# Altium schematic sheet BMS.SchDoc
size A; DocumentNumber: 2; SheetNumber: 2; SheetTotal: 3
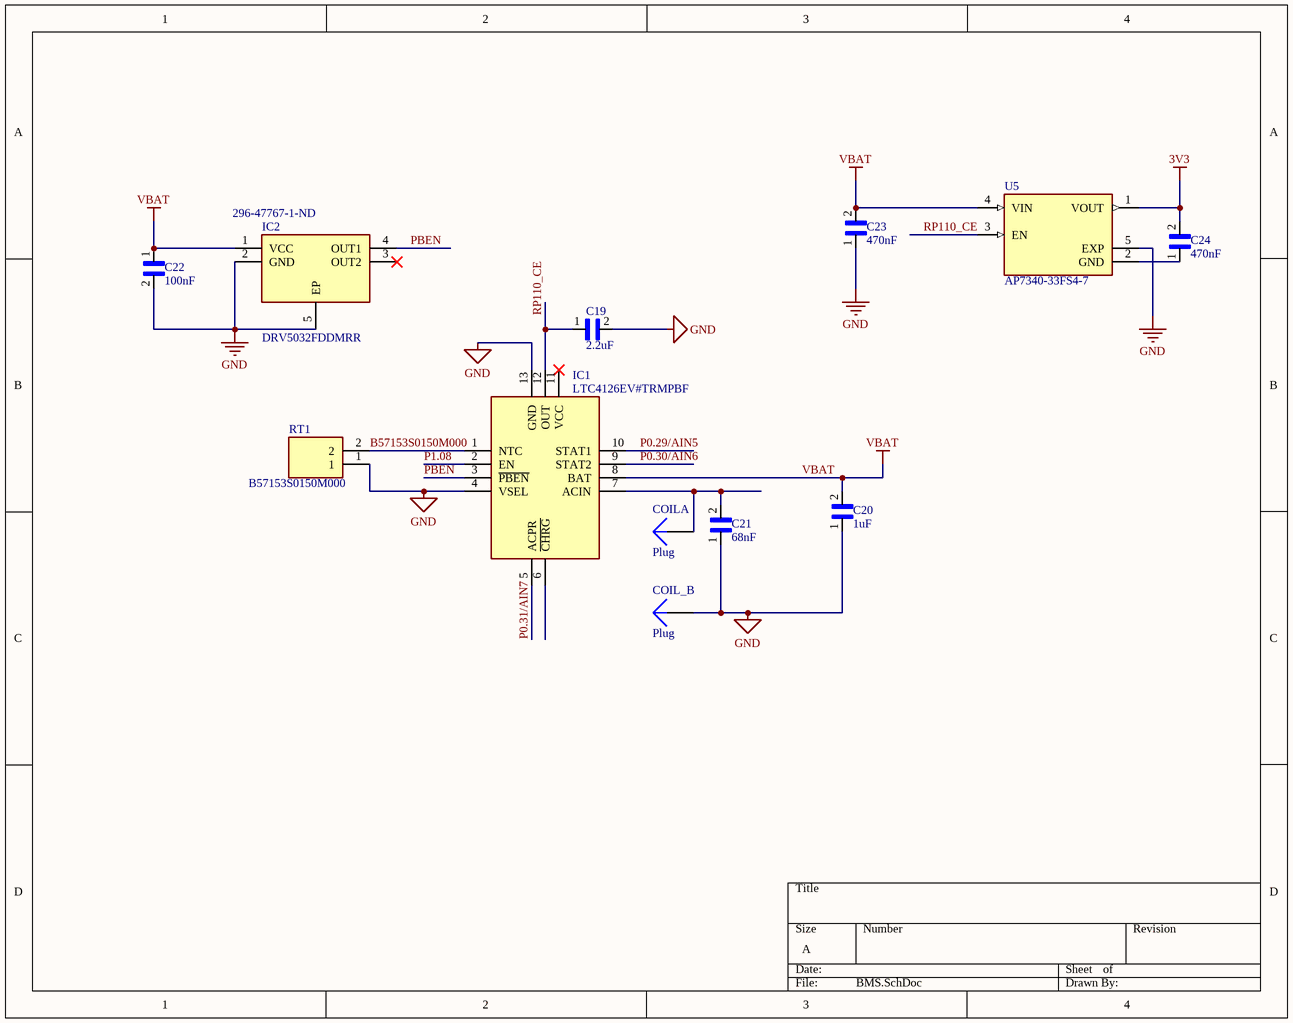
[diagram p0: BMS.SchDoc]

## Parts
C19  2.2uF  [CAPC1005X55N]
C20  1uF  [CAPC1005X56N]
C21  68nF  [CAPC1608X90N]
C22  100nF  [CAPC1005X55N]
C23  470nF  [CAPC0603X33N]
C24  470nF  [CAPC0603X33N]
COIL_B  Plug  [PIN1]
COILA  Plug  [PIN1]
IC1  LTC4126EV#TRMPBF  [QFN50P200X200X83-13N-D]
IC2  DRV5032FDDMRR  Supplier Part Number 1: 296-47767-1-ND  [SON50P140X110X40-5N]
RT1  B57153S0150M000  (graphical)
U5  AP7340-33FS4-7  [VREG_AP7340-33FS4-7]

## Nets
3V3: C24.2 U5.1(VOUT)
GND: C19.2 C20.1 C21.1 C22.2 C23.1 COIL_B.1 IC1.4(VSEL) IC1.13(GND) IC2.2(GND) IC2.5(EP) RT1.1 U5.5(EXP)
VBAT: C20.2 C22.1 C23.2 IC1.8(BAT) IC2.1(VCC) U5.4(VIN)
B57153S0150M000: IC1.1(NTC) RT1.2
P0.29/AIN5: IC1.10(STAT1)
P0.30/AIN6: IC1.9(STAT2)
P0.31/AIN7: IC1.5(ACPR)
P1.08: IC1.2(EN)
PBEN: IC1.3(~{PBEN}) IC2.4(OUT1)
RP110_CE: C19.1 IC1.12(OUT) U5.3(EN)
NetC21_2: C21.2 COILA.1 IC1.7(ACIN)
NetC24_1: C24.1 U5.2(GND)

Not connected (* = marked no-connect by the designer): IC1 6(~{CHRG}) 11(VCC)*; IC2 3(OUT2)*

## Library data of the parts
C19 = C1005X5R1C225M050BC: Cap Ceramic 2.2uF 16V X5R 20% SMD 0402 85C Paper T/R; Manufacturer: TDK; Supplier 1: Digi-Key; Manufacturer Part Number: C1005X5R1C225M050BC; RoHS: Yes; Category: Ceramic Capacitors; Stock 1: 5540; Pricing 1: 1=0.35000, 10=0.24200, 50=0.16100, 100=0.13680, 500=0.09660, 1000=0.08452, 2500=0.08050, 5000=0.07446 (USD); Mount: Surface Mount; Case/Package: 0402; Case Code (Metric): 1005; Case Code (Imperial): 0402; Weight: 2.3E-05oz; Dielectric Material: Ceramic; Min Operating Temperature: -55°C; Max Operating Temperature: 85°C; Tolerance: 20%; Packaging: Tape and Reel; Capacitance: 2.2uF; Voltage Rating: 16V; Termination: SMD/SMT; Package Quantity: 1; Voltage Rating (DC): 16V; Dielectric: X5R; Resistor Type: Ceramic; Series: C; Length: 1mm; Width: 0.02inch; Height: 0.5mm; Thickness: 0.022inch; Depth: 0.5mm; REACH SVHC: No SVHC; Lead Free: Lead Free; RoHS Compliant: Yes; ComponentLink1URL: https://datasheet.ciiva.com/24217/c1005x5r1c225m050bc-264319-24217866.pdf?src-supplier=Mouser; ComponentLink1Description: https://datasheet.ciiva.com/24217/c1005x5r1c225m050bc-264319-24217866.pdf?src-supplier=Mouser; ComponentLink2URL: https://datasheet.ciiva.com/6290/tdkmlcccaprange-6290133.pdf?src-supplier=Digi-Key; ComponentLink2Description: https://datasheet.ciiva.com/6290/tdkmlcccaprange-6290133.pdf?src-supplier=Digi-Key; ComponentLink3URL: https://datasheet.ciiva.com/6290/tdkmlcccaprange-6290135.pdf?src-supplier=Digi-Key; ComponentLink3Description: https://datasheet.ciiva.com/6290/tdkmlcccaprange-6290135.pdf?src-supplier=Digi-Key
C20 = 0402YD105KAT2A: 0402 1 uF 16 V ±10 % Tolerance X5R Surface Mount Multilayer Ceramic Capacitor; Manufacturer: Kyocera AVX; Tolerance: 10%; Voltage Rating: 16V; Supplier 1: Digi-Key; Manufacturer Part Number: 0402YD105KAT2A; RoHS: Yes; Category: Ceramic Capacitors; Stock 1: 27570; Pricing 1: 1=0.39000, 10=0.26500, 50=0.17660, 100=0.15010, 500=0.10598, 1000=0.09274, 2500=0.08832, 5000=0.08170 (USD); Mount: Surface Mount; Case/Package: 0402; Number of Pins: 2; Case Code (Metric): 1005; Case Code (Imperial): 0402; Weight: 2.3E-05oz; Contact Plating: Tin; Min Operating Temperature: -55°C; Max Operating Temperature: 85°C; Capacitance: 1uF; Packaging: Tape and Reel; Package Quantity: 10000; Voltage Rating (DC): 16V; Dielectric: X5R; Termination: SMD/SMT; Construction: Flat; Length: 0.039inch; Width: 0.02inch; Thickness: 0.022inch; Depth: 0.5mm; REACH SVHC: No SVHC; Lead Free: Lead Free; RoHS Compliant: Yes; ComponentLink1URL: https://datasheet.ciiva.com/1126/1598274-1126025.pdf?src-supplier=Farnell; ComponentLink1Description: https://datasheet.ciiva.com/1126/1598274-1126025.pdf?src-supplier=Farnell; ComponentLink2URL: https://datasheet.ciiva.com/1124/1598274-1124011.pdf?src-supplier=Element14; ComponentLink2Description: https://datasheet.ciiva.com/1124/1598274-1124011.pdf?src-supplier=Element14; ComponentLink3URL: https://datasheet.ciiva.com/6269/cx5r-6269291.pdf?src-supplier=Digi-Key; ComponentLink3Description: https://datasheet.ciiva.com/6269/cx5r-6269291.pdf?src-supplier=Digi-Key
C21 = 0603YC683JAT2A: 0603 68 nF 16 V ±5 % Tolerance X7R Surface Mount Multilayer Ceramic Capacitor; Manufacturer: Kyocera AVX; Tolerance: 5%; Voltage Rating (DC): 16V; Supplier 1: Newark; Manufacturer Part Number: 0603YC683JAT2A; RoHS: Yes; Category: Ceramic Capacitors; Mount: Surface Mount; Case/Package: 0603; Number of Pins: 2; Contact Plating: Tin,Matte; Case Code (Metric): 1608; Case Code (Imperial): 0603; Min Operating Temperature: -55°C; Max Operating Temperature: 125°C; Capacitance: 68nF; Dielectric: X7R; Packaging: Tape and Reel; Package Quantity: 1; Termination: SMD/SMT; Series: -; Voltage Rating: 16V; Construction: Flat; Length: 1.6mm; Width: 0.032inch; Depth: 0.81mm; Thickness: 0.035inch; Radiation Hardening: No; Lead Free: Lead Free; REACH SVHC: Unknown; RoHS Compliant: Yes; ComponentLink1URL: https://datasheet.ciiva.com/11577/cx7r-11577158.pdf?src-supplier=Avnet; ComponentLink1Description: https://datasheet.ciiva.com/11577/cx7r-11577158.pdf?src-supplier=Avnet; ComponentLink2URL: https://datasheet.ciiva.com/16507/cx7r-16507206.pdf?src-supplier=Future+Electronics; ComponentLink2Description: https://datasheet.ciiva.com/16507/cx7r-16507206.pdf?src-supplier=Future+Electronics; ComponentLink3URL: https://datasheet.ciiva.com/152/cx7r-152731.pdf?src-supplier=Digi-Key; ComponentLink3Description: https://datasheet.ciiva.com/152/cx7r-152731.pdf?src-supplier=Digi-Key; ComponentLink4URL: https://datasheet.ciiva.com/14912/cx7r-14912559.pdf?src-supplier=Digi-Key; ComponentLink4Description: https://datasheet.ciiva.com/14912/cx7r-14912559.pdf?src-supplier=Digi-Key
C22 = CL05B104KP5NNNC: Cap Ceramic 0.1uF 10V X7R 10% Pad SMD 0402 125C T/R; Manufacturer: Samsung; Supplier 1: Digi-Key; Manufacturer Part Number: CL05B104KP5NNNC; RoHS: Yes; Category: Ceramic Capacitors; Stock 1: 6904136; Pricing 1: 1=0.10000, 10=0.02700, 50=0.01460, 100=0.01200, 500=0.00858, 1000=0.00674, 2500=0.00612, 5000=0.00563 (USD); Mount: Surface Mount; Case/Package: 0402; Case Code (Metric): 1005; Case Code (Imperial): 0402; Contact Plating: Tin; Min Operating Temperature: -55°C; Max Operating Temperature: 125°C; Capacitance: 100nF; Package Quantity: 1; Packaging: Tape and Reel; Tolerance: 10%; Voltage Rating: 10V; Dielectric: X7R; Series: CL; Construction: Flat; Length: 1mm; Width: 0.02inch; Height: 0.5mm; Thickness: 0.022inch; Depth: 0.5mm; Radiation Hardening: No; RoHS Compliant: Yes; ComponentLink1URL: https://datasheet.ciiva.com/15165/getdatasheetpartid-37100-15165107.pdf?src-supplier=Verical; ComponentLink1Description: https://datasheet.ciiva.com/15165/getdatasheetpartid-37100-15165107.pdf?src-supplier=Verical; ComponentLink2URL: https://datasheet.ciiva.com/26787/cl05b104kp5nnnc-26787004.pdf?src-supplier=IIIC; ComponentLink2Description: https://datasheet.ciiva.com/26787/cl05b104kp5nnnc-26787004.pdf?src-supplier=IIIC; ComponentLink3URL: https://datasheet.ciiva.com/16498/cl05b104kq5nnnc-16498491.pdf?src-supplier=Future+Electronics; ComponentLink3Description: https://datasheet.ciiva.com/16498/cl05b104kq5nnnc-16498491.pdf?src-supplier=Future+Electronics
C23 C24 = 02016D474KAT2A: Cap Ceramic 0.47uF 6.3V X5R 10% SMD 0201 85C Paper T/R; Manufacturer: Kyocera AVX; Supplier 1: Digi-Key; Manufacturer Part Number: 02016D474KAT2A; RoHS: Yes; Category: Ceramic Capacitors; Stock 1: 336619; Pricing 1: 1=0.10000, 10=0.05900, 50=0.03240, 100=0.02650, 500=0.01892, 1000=0.01486, 2500=0.01351, 5000=0.01243 (USD); Case/Package: 0201; Min Operating Temperature: -55°C; Max Operating Temperature: 85°C; Capacitance: 470nF; Package Quantity: 15000; Tolerance: 10%; Packaging: Tape and Reel; Voltage Rating (DC): 6.3V; Dielectric: X5R; Length: 0.6mm; Depth: 0.3mm; RoHS Compliant: Yes; ComponentLink1URL: https://datasheet.ciiva.com/13272/cx5r-33896-13272439.pdf?src-supplier=Mouser; ComponentLink1Description: https://datasheet.ciiva.com/13272/cx5r-33896-13272439.pdf?src-supplier=Mouser
IC1 = LTC4126EV#TRMPBF: Linear Battery Charger Li-Ion 7.5mA 4.2V/4.35V 12-Pin LQFN EP T/R; Manufacturer: Analog Devices / Linear Technology; Manufacturer Part Number: LTC4126EV#TRPBF; Supplier 1: Digi-Key; RoHS: Yes; Category: Battery Management; Pricing 1: 1=6.48000, 10=5.85700, 25=5.58480, 100=4.84910, 250=4.63112, 500=4.24050 (USD); RoHS Compliant: No
IC2 = DRV5032FDDMRR: Low power (5 Hz, <1µA), low voltage (up to 5.5V) switch 4-X2SON -40 to 85; Manufacturer: Texas Instruments; Sensing Method: Hall Effect; Max Supply Current: 2.7mA; Max Output Current: 5mA; Supplier 1: Digi-Key; Manufacturer Part Number: DRV5032FDDMRR; RoHS: Yes; Category: Integrated Circuits (ICs); Pricing 1: 1=0.89000, 10=0.78000, 25=0.73280, 100=0.59800, 250=0.55548, 500=0.47276, 1000=0.39025 (USD); Min Operating Temperature: -40°C; Max Operating Temperature: 85°C; Packaging: Cut Tape; RoHS Compliant: Yes; ComponentLink1URL: http://www.ti.com/lit/ds/symlink/drv5032.pdf?src-supplier=Digi-Key; ComponentLink1Description: http://www.ti.com/lit/ds/symlink/drv5032.pdf?src-supplier=Digi-Key; ComponentLink2URL: http://www.ti.com/general/docs/suppproductinfo.tsp?distId=10&amp;gotoUrl=http%3A%2F%2Fwww.ti.com%2Flit%2Fgpn%2Fdrv5032&src-supplier=Digi-Key; ComponentLink2Description: http://www.ti.com/general/docs/suppproductinfo.tsp?distId=10&amp;gotoUrl=http%3A%2F%2Fwww.ti.com%2Flit%2Fgpn%2Fdrv5032&src-supplier=Digi-Key
RT1 = B57153S0150M000: Inrush current limiters include PTC and NTC Thermistors.; Manufacturer: TDK EPCOS; Current Rating: 1.8A; Tolerance: 20%; Operating Supply Voltage: 265V; Lead Length: 25mm; Approvals: UL; Supplier 1: Digi-Key; Manufacturer Part Number: B57153S0150M000; RoHS: Yes; Category: Thermistors; Stock 1: 1322; Pricing 1: 1=0.57000, 5=0.55000, 10=0.53200, 50=0.44780, 100=0.37180, 250=0.33800, 500=0.28730, 1000=0.25350, 5000=0.22815 (USD); Case/Package: Radial; Number of Pins: 2; Min Operating Temperature: -55°C; Max Operating Temperature: 170°C; Packaging: Bulk; Diameter: 8.5mm; Depth: 6mm; Thickness: 6mm; Radiation Hardening: No; RoHS Compliant: Yes; REACH SVHC: No SVHC; Lead Free: Lead Free; ComponentLink1URL: https://datasheet.ciiva.com/15097/getdatasheetpartid-382123-15097837.pdf?src-supplier=Verical; ComponentLink1Description: https://datasheet.ciiva.com/15097/getdatasheetpartid-382123-15097837.pdf?src-supplier=Verical; ComponentLink2URL: https://datasheet.ciiva.com/29386/419724-da-01-en-ntc-sensor-b57153s0150m000-29386961.pdf?src-supplier=Conrad; ComponentLink2Description: https://datasheet.ciiva.com/29386/419724-da-01-en-ntc-sensor-b57153s0150m000-29386961.pdf?src-supplier=Conrad
U5 = AP7340-33FS4-7: AP7340 Series 3.3 V Fixed Output 150 mA SMT LDO Regulator - DFN1010-4; Manufacturer: Diodes; Output Current: 150mA; Number of Outputs: 1; Min Input Voltage: 1.7V; Max Input Voltage: 5.25V; Output Voltage: 3.3V; Max Power Dissipation: 400mW; Dropout Voltage: 210mV; Quiescent Current: 50uA; Polarity: Positive; Accuracy: 1%; Supplier 1: Digi-Key; Manufacturer Part Number: AP7340-33FS4-7; RoHS: Yes; Category: Voltage Regulators - Linear; Stock 1: 94687; Pricing 1: 1=0.39000, 10=0.31400, 25=0.28720, 100=0.21370, 250=0.19368, 500=0.16028, 1000=0.12020, 2500=0.11019 (USD); Mount: Surface Mount; Case/Package: DFN; Number of Pins: 4; Contact Plating: Gold; Min Operating Temperature: -40°C; Max Operating Temperature: 85°C; Packaging: Tape and Reel; Max Output Current: 150mA; Package Quantity: 5000; Number of Regulators: 1; Power Rating: 400mW; Output Type: Fixed; Length: 1.05mm; Width: 1.05mm; Height: 0.35mm; Lead Free: Lead Free; RoHS Compliant: Yes; ComponentLink1URL: https://datasheet.ciiva.com/29568/ap7340-29568831.pdf?src-supplier=Digi-Key; ComponentLink1Description: https://datasheet.ciiva.com/29568/ap7340-29568831.pdf?src-supplier=Digi-Key; ComponentLink2URL: https://datasheet.ciiva.com/30016/ap7340-30016698.pdf?src-supplier=Avnet; ComponentLink2Description: https://datasheet.ciiva.com/30016/ap7340-30016698.pdf?src-supplier=Avnet
COIL_B COILA = Plug: LatestRevisionDate: 17-Jul-2002; LatestRevisionNote: Re-released for DXP Platform.; Publisher: Altium Limited